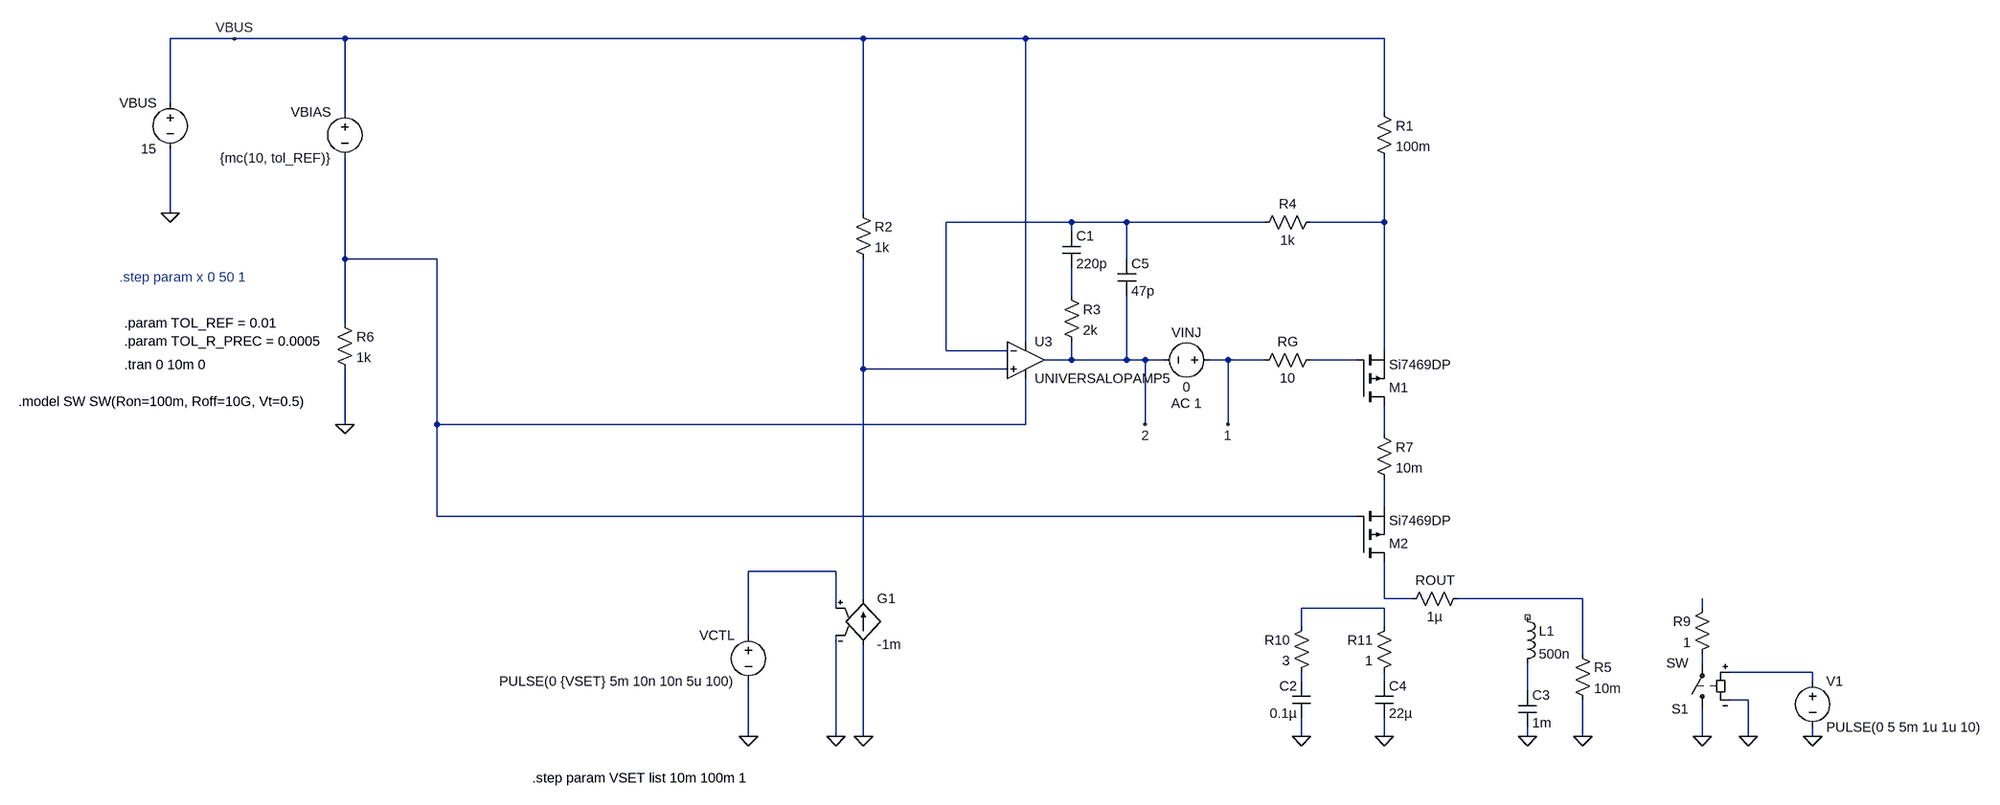
[diagram p0: schematic Voltage_Controlled_Current_Source.asc]
Voltage_Controlled_Current_Source.asc, the LTspice schematic file:
Version 4
SHEET 1 2248 1272
WIRE -1600 -32 -1712 -32
WIRE -1408 -32 -1600 -32
WIRE 256 -32 -1408 -32
WIRE 560 -32 256 -32
WIRE 1184 -32 560 -32
WIRE -1712 80 -1712 -32
WIRE -1408 96 -1408 -32
WIRE 1184 96 1184 -32
WIRE -1712 272 -1712 160
WIRE 256 272 256 -32
WIRE 640 288 400 288
WIRE 736 288 640 288
WIRE 976 288 736 288
WIRE 1184 288 1184 176
WIRE 1184 288 1056 288
WIRE 640 304 640 288
WIRE -1408 352 -1408 176
WIRE -1184 352 -1408 352
WIRE 736 352 736 288
WIRE 640 416 640 368
WIRE -1408 464 -1408 352
WIRE 560 496 560 -32
WIRE 400 512 400 288
WIRE 528 512 400 512
WIRE 1184 512 1184 288
WIRE 640 528 640 496
WIRE 640 528 592 528
WIRE 736 528 736 416
WIRE 736 528 640 528
WIRE 768 528 736 528
WIRE 800 528 768 528
WIRE 912 528 880 528
WIRE 976 528 912 528
WIRE 1136 528 1056 528
WIRE 256 544 256 352
WIRE 528 544 256 544
WIRE -1408 640 -1408 544
WIRE -1184 640 -1184 352
WIRE 560 640 560 560
WIRE 560 640 -1184 640
WIRE 768 640 768 528
WIRE 912 640 912 528
WIRE 1184 656 1184 608
WIRE 1184 784 1184 736
WIRE -1184 800 -1184 640
WIRE 1136 800 -1184 800
WIRE 208 896 -144 896
WIRE 256 944 256 544
WIRE 1184 944 1184 880
WIRE 1232 944 1184 944
WIRE 1536 944 1312 944
WIRE 208 960 208 896
WIRE 1184 960 1040 960
WIRE 1744 960 1744 944
WIRE 1040 992 1040 960
WIRE 1184 992 1184 960
WIRE -144 1008 -144 896
WIRE 1536 1040 1536 944
WIRE 1744 1056 1744 1040
WIRE 1936 1072 1792 1072
WIRE 1040 1088 1040 1072
WIRE 1184 1088 1184 1072
WIRE 1936 1088 1936 1072
WIRE 1440 1104 1440 1056
WIRE 1824 1120 1792 1120
WIRE -144 1184 -144 1088
WIRE 208 1184 208 1008
WIRE 256 1184 256 1024
WIRE 1040 1184 1040 1152
WIRE 1184 1184 1184 1152
WIRE 1440 1184 1440 1168
WIRE 1536 1184 1536 1120
WIRE 1744 1184 1744 1136
WIRE 1824 1184 1824 1120
WIRE 1936 1184 1936 1168
FLAG -1408 640 0
FLAG -1712 272 0
FLAG -1600 -32 VBUS
FLAG 1536 1184 0
FLAG 1744 1184 0
FLAG 1936 1184 0
FLAG 1824 1184 0
FLAG 1440 1184 0
FLAG 1184 1184 0
FLAG 1040 1184 0
FLAG 256 1184 0
FLAG -144 1184 0
FLAG 208 1184 0
FLAG 768 640 2
FLAG 912 640 1
SYMBOL voltage -1408 80 M0
WINDOW 123 0 0 Left 0
WINDOW 39 0 0 Left 0
SYMATTR InstName VBIAS
SYMATTR Value {mc(10, tol_REF)}
SYMBOL res -1424 448 R0
SYMATTR InstName R6
SYMATTR Value 1k
SYMBOL voltage -1712 64 M0
WINDOW 123 0 0 Left 0
WINDOW 39 0 0 Left 0
SYMATTR InstName VBUS
SYMATTR Value 15
SYMBOL OpAmps\\UniversalOpAmp5 560 528 R0
SYMATTR InstName U3
SYMATTR Value2 Avol=1Meg GBW=330Meg Phimargin=60 SlewPos=500Meg SlewNeg=500Meg
SYMATTR SpiceLine2 Vos=0 Ibp=2n Ibn=1n Iq=1m Rail=50m Ilimit=50m
SYMBOL pmos 1136 608 M180
SYMATTR InstName M1
SYMATTR Value Si7469DP
SYMBOL res 1520 1024 R0
SYMATTR InstName R5
SYMATTR Value 10m
SYMBOL sw 1744 1152 R180
SYMATTR InstName S1
SYMBOL res 1760 944 M0
SYMATTR InstName R9
SYMATTR Value 1
SYMBOL res 1072 512 R90
WINDOW 0 0 56 VBottom 2
WINDOW 3 32 56 VTop 2
SYMATTR InstName RG
SYMATTR Value 10
SYMBOL voltage 1936 1072 R0
WINDOW 123 0 0 Left 0
WINDOW 39 0 0 Left 0
SYMATTR InstName V1
SYMATTR Value PULSE(0 5 5m 1u 1u 10)
SYMBOL res 1216 960 R270
WINDOW 0 32 56 VTop 2
WINDOW 3 0 56 VBottom 2
SYMATTR InstName ROUT
SYMATTR Value 1µ
SYMBOL cap 1424 1104 R0
SYMATTR InstName C3
SYMATTR Value 1m
SYMBOL ind 1424 960 R0
SYMATTR InstName L1
SYMATTR Value 500n
SYMBOL pmos 1136 880 M180
SYMATTR InstName M2
SYMATTR Value Si7469DP
SYMBOL res 1056 976 M0
SYMATTR InstName R10
SYMATTR Value 3
SYMBOL res 1200 976 M0
SYMATTR InstName R11
SYMATTR Value 1
SYMBOL cap 1056 1088 M0
SYMATTR InstName C2
SYMATTR Value 0.1µ
SYMBOL cap 1168 1088 R0
SYMATTR InstName C4
SYMATTR Value 22µ
SYMBOL res 1168 80 R0
SYMATTR InstName R1
SYMATTR Value 100m
SYMBOL res 240 256 R0
SYMATTR InstName R2
SYMATTR Value 1k
SYMBOL g 256 928 R0
SYMATTR InstName G1
SYMATTR Value -1m
SYMBOL voltage -144 992 M0
WINDOW 123 0 0 Left 0
WINDOW 39 0 0 Left 0
SYMATTR InstName VCTL
SYMATTR Value PULSE(0 {VSET} 5m 10n 10n 5u 100)
SYMBOL cap 624 304 R0
SYMATTR InstName C1
SYMATTR Value 220p
SYMBOL res 624 400 R0
SYMATTR InstName R3
SYMATTR Value 2k
SYMBOL res 1072 272 R90
WINDOW 0 0 56 VBottom 2
WINDOW 3 32 56 VTop 2
SYMATTR InstName R4
SYMATTR Value 1k
SYMBOL cap 720 352 R0
SYMATTR InstName C5
SYMATTR Value 47p
SYMBOL res 1168 640 R0
SYMATTR InstName R7
SYMATTR Value 10m
SYMBOL voltage 896 528 R90
WINDOW 0 -32 56 VBottom 2
WINDOW 3 32 56 VTop 2
WINDOW 123 60 56 VTop 2
WINDOW 39 0 0 Left 0
SYMATTR InstName VINJ
SYMATTR Value 0
SYMATTR Value2 AC 1
TEXT -1792 464 Left 2 !.param TOL_REF = 0.01\n.param TOL_R_PREC = 0.0005
TEXT -1800 384 Left 2 ;.step param x 0 50 1
TEXT -1792 536 Left 2 !.tran 0 10m 0
TEXT -1976 600 Left 2 !.model SW SW(Ron=100m, Roff=10G, Vt=0.5)
TEXT -520 1256 Left 2 !.step param VSET list 10m 100m 1

The netlist it stands for:
* Voltage_Controlled_Current_Source.asc
VBIAS VBUS N003 {mc(10, tol_REF)}
R6 N003 0 1k
VBUS VBUS 0 15
XU3 N006 N001 VBUS N003 2 Avol=1Meg GBW=330Meg Phimargin=60 SlewPos=500Meg SlewNeg=500Meg Vos=0 Ibp=2n Ibn=1n Iq=1m Rail=50m Ilimit=50m  ; UNIVERSALOPAMP5, pins In+ In- V+ V- OUT
M1 N007 N005 N002 N002 Si7469DP
R5 N011 0 10m
S1 0 N014 N015 0 SW
R9 N013 N014 1
RG N005 1 10
V1 N015 0 PULSE(0 5 5m 1u 1u 10)
ROUT N010 N011 1µ
C3 N018 0 1m
L1 NC_01 N018 500n
M2 N010 N003 N008 N008 Si7469DP
R10 N012 N016 3
R11 N012 N017 1
C2 N016 0 0.1µ
C4 N017 0 22µ
R1 VBUS N002 100m
R2 VBUS N006 1k
G1 0 N006 N009 0 -1m
VCTL N009 0 PULSE(0 {VSET} 5m 10n 10n 5u 100)
C1 N001 N004 220p
R3 N004 2 2k
R4 N002 N001 1k
C5 N001 2 47p
R7 N007 N008 10m
VINJ 1 2 0 AC 1
.model NMOS NMOS
.model PMOS PMOS
.lib standard.mos
.param TOL_REF = 0.01
.param TOL_R_PREC = 0.0005
* .step param x 0 50 1
.tran 0 10m 0
.model SW SW(Ron=100m, Roff=10G, Vt=0.5)
.step param VSET list 10m 100m 1
.backanno
.end